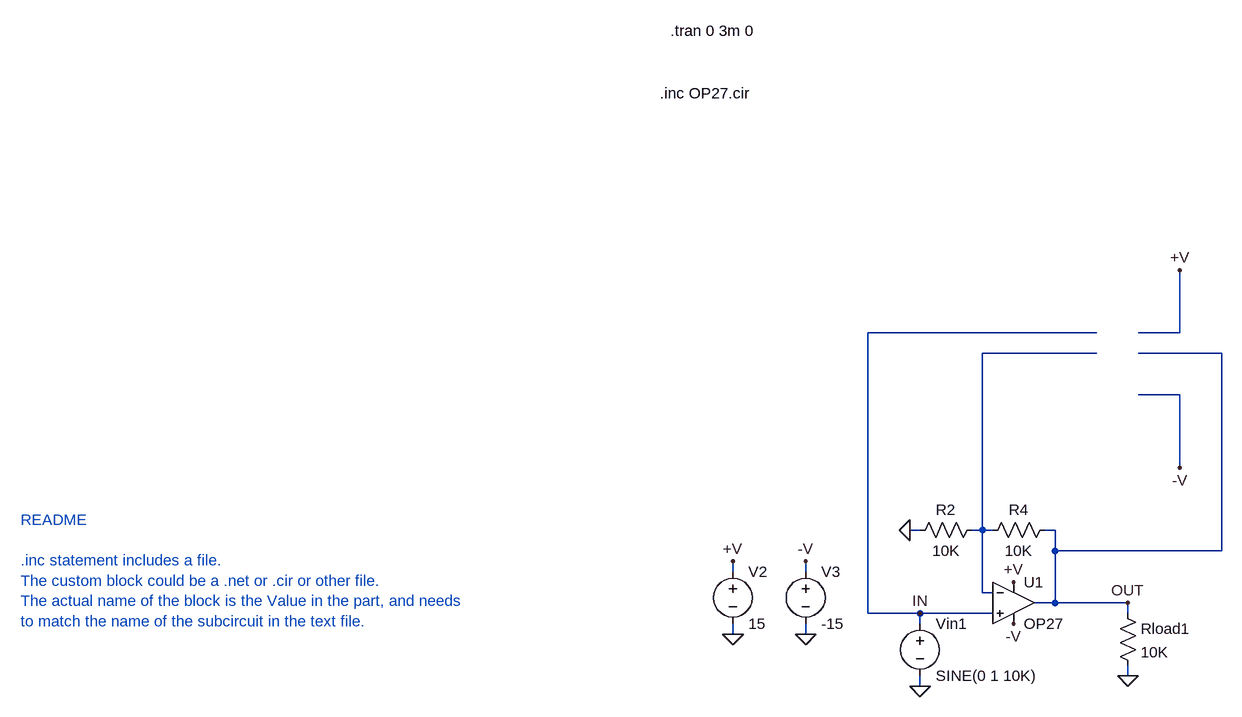
[diagram p0: schematic testbenchOP27.asc]
testbenchOP27.asc, the LTspice schematic file:
Version 4
SHEET 1 3184 680
WIRE 2512 -464 2160 -464
WIRE 2640 -464 2640 -560
WIRE 2640 -464 2576 -464
WIRE 2512 -432 2336 -432
WIRE 2704 -432 2576 -432
WIRE 2640 -368 2576 -368
WIRE 2640 -256 2640 -368
WIRE 2240 -160 2224 -160
WIRE 2336 -160 2336 -432
WIRE 2336 -160 2320 -160
WIRE 2352 -160 2336 -160
WIRE 2448 -160 2432 -160
WIRE 2448 -128 2448 -160
WIRE 2704 -128 2704 -432
WIRE 2704 -128 2448 -128
WIRE 1952 -96 1952 -112
WIRE 2064 -96 2064 -112
WIRE 2336 -64 2336 -160
WIRE 2352 -64 2336 -64
WIRE 2448 -48 2448 -128
WIRE 2448 -48 2416 -48
WIRE 2560 -48 2448 -48
WIRE 2160 -32 2160 -464
WIRE 2240 -32 2160 -32
WIRE 2352 -32 2240 -32
WIRE 2560 -32 2560 -48
WIRE 2240 -16 2240 -32
WIRE 1952 0 1952 -16
WIRE 2064 0 2064 -16
WIRE 2560 64 2560 48
WIRE 2240 80 2240 64
FLAG 1952 -112 +V
FLAG 1952 0 0
FLAG 2240 80 0
FLAG 2560 -48 OUT
FLAG 2240 -32 IN
FLAG 2384 -80 +V
FLAG 2064 -112 -V
FLAG 2384 -16 -V
FLAG 2224 -160 0
FLAG 2560 64 0
FLAG 2064 0 0
FLAG 2640 -560 +V
FLAG 2640 -256 -V
SYMBOL voltage 1952 -112 R0
WINDOW 123 0 0 Left 2
WINDOW 39 0 0 Left 2
SYMATTR InstName V2
SYMATTR Value 15
SYMBOL voltage 2240 -32 R0
WINDOW 123 24 146 Left 2
WINDOW 39 24 125 Left 2
SYMATTR InstName Vin1
SYMATTR Value SINE(0 1 10K)
SYMBOL res 2336 -176 R90
WINDOW 0 0 56 VBottom 2
WINDOW 3 32 56 VTop 2
SYMATTR InstName R2
SYMATTR Value 10K
SYMBOL res 2448 -176 R90
WINDOW 0 0 56 VBottom 2
WINDOW 3 32 56 VTop 2
SYMATTR InstName R4
SYMATTR Value 10K
SYMBOL voltage 2064 -112 R0
WINDOW 123 24 146 Left 2
WINDOW 39 24 125 Left 2
SYMATTR InstName V3
SYMATTR Value -15
SYMBOL res 2544 -48 R0
SYMATTR InstName Rload1
SYMATTR Value 10K
SYMBOL OP27 2384 -112 R0
SYMATTR InstName U1
TEXT 1856 -928 Left 2 !.tran 0 3m 0
TEXT 1840 -832 Left 2 !.inc OP27.cir
TEXT 856 -176 Left 2 ;README\n \n.inc statement includes a file.  \nThe custom block could be a .net or .cir or other file.\nThe actual name of the block is the Value in the part, and needs \nto match the name of the subcircuit in the text file.

The netlist it stands for:
* testbenchOP27.asc
V2 +V 0 15
Vin1 IN 0 SINE(0 1 10K)
R2 N001 0 10K
R4 OUT N001 10K
V3 -V 0 -15
Rload1 OUT 0 10K
XU1 IN N001 +V -V OUT OP27  ; pins In+ In- V+ V- OUT
.tran 0 3m 0
.inc OP27.cir
* README
* .inc statement includes a file.
* The custom block could be a .net or .cir or other file.
* The actual name of the block is the Value in the part, and needs
* to match the name of the subcircuit in the text file.
.lib ADI.lib
.backanno
.end